# Altium schematic sheet swd.SchDoc
size A4
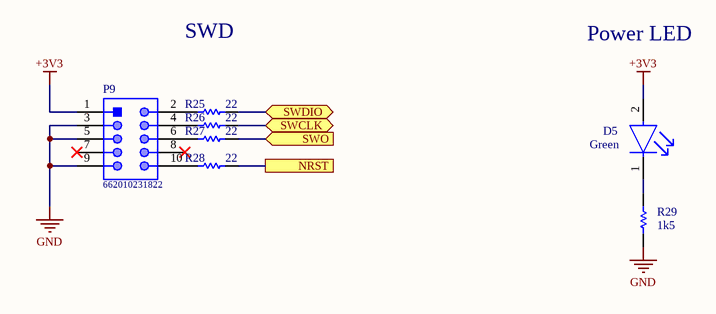
[diagram p0: swd.SchDoc]

## Parts
D5  Green  [Led 0603]
P9  662010231822  [HDRV10W90P254_2X5_1270X483X840P]
R25  22  [Resistor 0402]
R26  22  [Resistor 0402]
R27  22  [Resistor 0402]
R28  22  [Resistor 0402]
R29  1k5  [RESISTOR 0603]

## Ports
NRST, SWCLK (bidir), SWDIO (bidir), SWO (in)

## Nets
+3V3: D5.2(A) P9.1
GND: P9.3 P9.5 P9.9 R29.1
NRST: R28.1 ; port NRST
SWCLK: R26.1 ; port SWCLK
SWDIO: R25.1 ; port SWDIO
SWO: R27.1 ; port SWO
NetD5_1: D5.1(C) R29.2
NetP9_2: P9.2 R25.2
NetP9_4: P9.4 R26.2
NetP9_6: P9.6 R27.2
NetP9_10: P9.10 R28.2

Not connected (* = marked no-connect by the designer): P9 7* 8*

## Notes on the sheet
- SWD
- Power LED

## Library data of the parts
D5 = LED 0805: Manufacturer: Vishay Lite-On; Manufacturer Part Number: LTST-C190GKT; Lens Transparency: Clear; Reverse Voltage: 5V; Power Dissipation: 100mW; Forward Voltage: 2.1V; Test Current: 10mA; Number of LEDs: 1; Viewing Angle: 130°; Forward Current: 30mA; Voltage: 2V; Wavelength: 565nm; Dominant Wavelength: 569nm; Luminous Intensity: 6mcd; Lens Color: Colorless; Packaging: Tape and Reel; Min Operating Temperature: -55°C; Case Code (Metric): 1608; Lens Style: Clear; Case/Package: 0603; Mount: Surface Mount; Package Quantity: 1; Height: 0.8mm; Illumination Color: Green; Radiation Hardening: No; Depth: 0.8mm; Number of Pins: 2; Max Operating Temperature: 85°C; Color: Green; Number of Elements: 1; Power Rating: 100mW; Case Code (Imperial): 0603; Width: 0.8mm; Length: 1.6mm; Lead Free: Lead Free
P9 = Male Header 02x05: SMT Male Header WR-MPC3, with SMT Solder Tabs, Vertical, Dual Row, pitch 3 mm, 10 pins; Manufacturer: Wurth Electronics; Working Voltage: 250VAC; Pin Number: 10; Contact Resistance: 10mOhm; Pitch: 3mm; Gender: Male; Publisher: WurthElektronik; Datasheet URL: https://katalog.we-online.de/em/datasheet/6620xx231822.pdf; Mounting Technology: SMT; Packaging: Tray; Operating Temperature: -40to105degC; Package Reference: 662010231822; Orientation: Vertical; Part Number: 662010231822; Manufacturer URL: http://www.we-online.de; Manufacturer Part Number: 662010231822
R25-R28 = Resistor 0402: Chip Resistor 0402; Manufacturer: Vishay; Part Number: CRCW0402120RFKED; Manufacturer Part Number: CRCW0402120RFKED
R29 = Resistor 0603: Chip Resistor 0603; Manufacturer: Vishay; Part Number: CRCW0402120RFKED; Manufacturer Part Number: CRCW0402120RFKED